# EasyEDA Pro project ProProject_无线温湿度检测系统1_2024-10-27.epro, schematic Schematic6
Create Date: 2023-12-08; Page Name: P1; Project Name: 无线温湿度检测系统1; Schematic Name: Schematic6; Update Date: 2023-12-08; Company: 嘉立创EDA; Page Size: A4; Version: V1.0
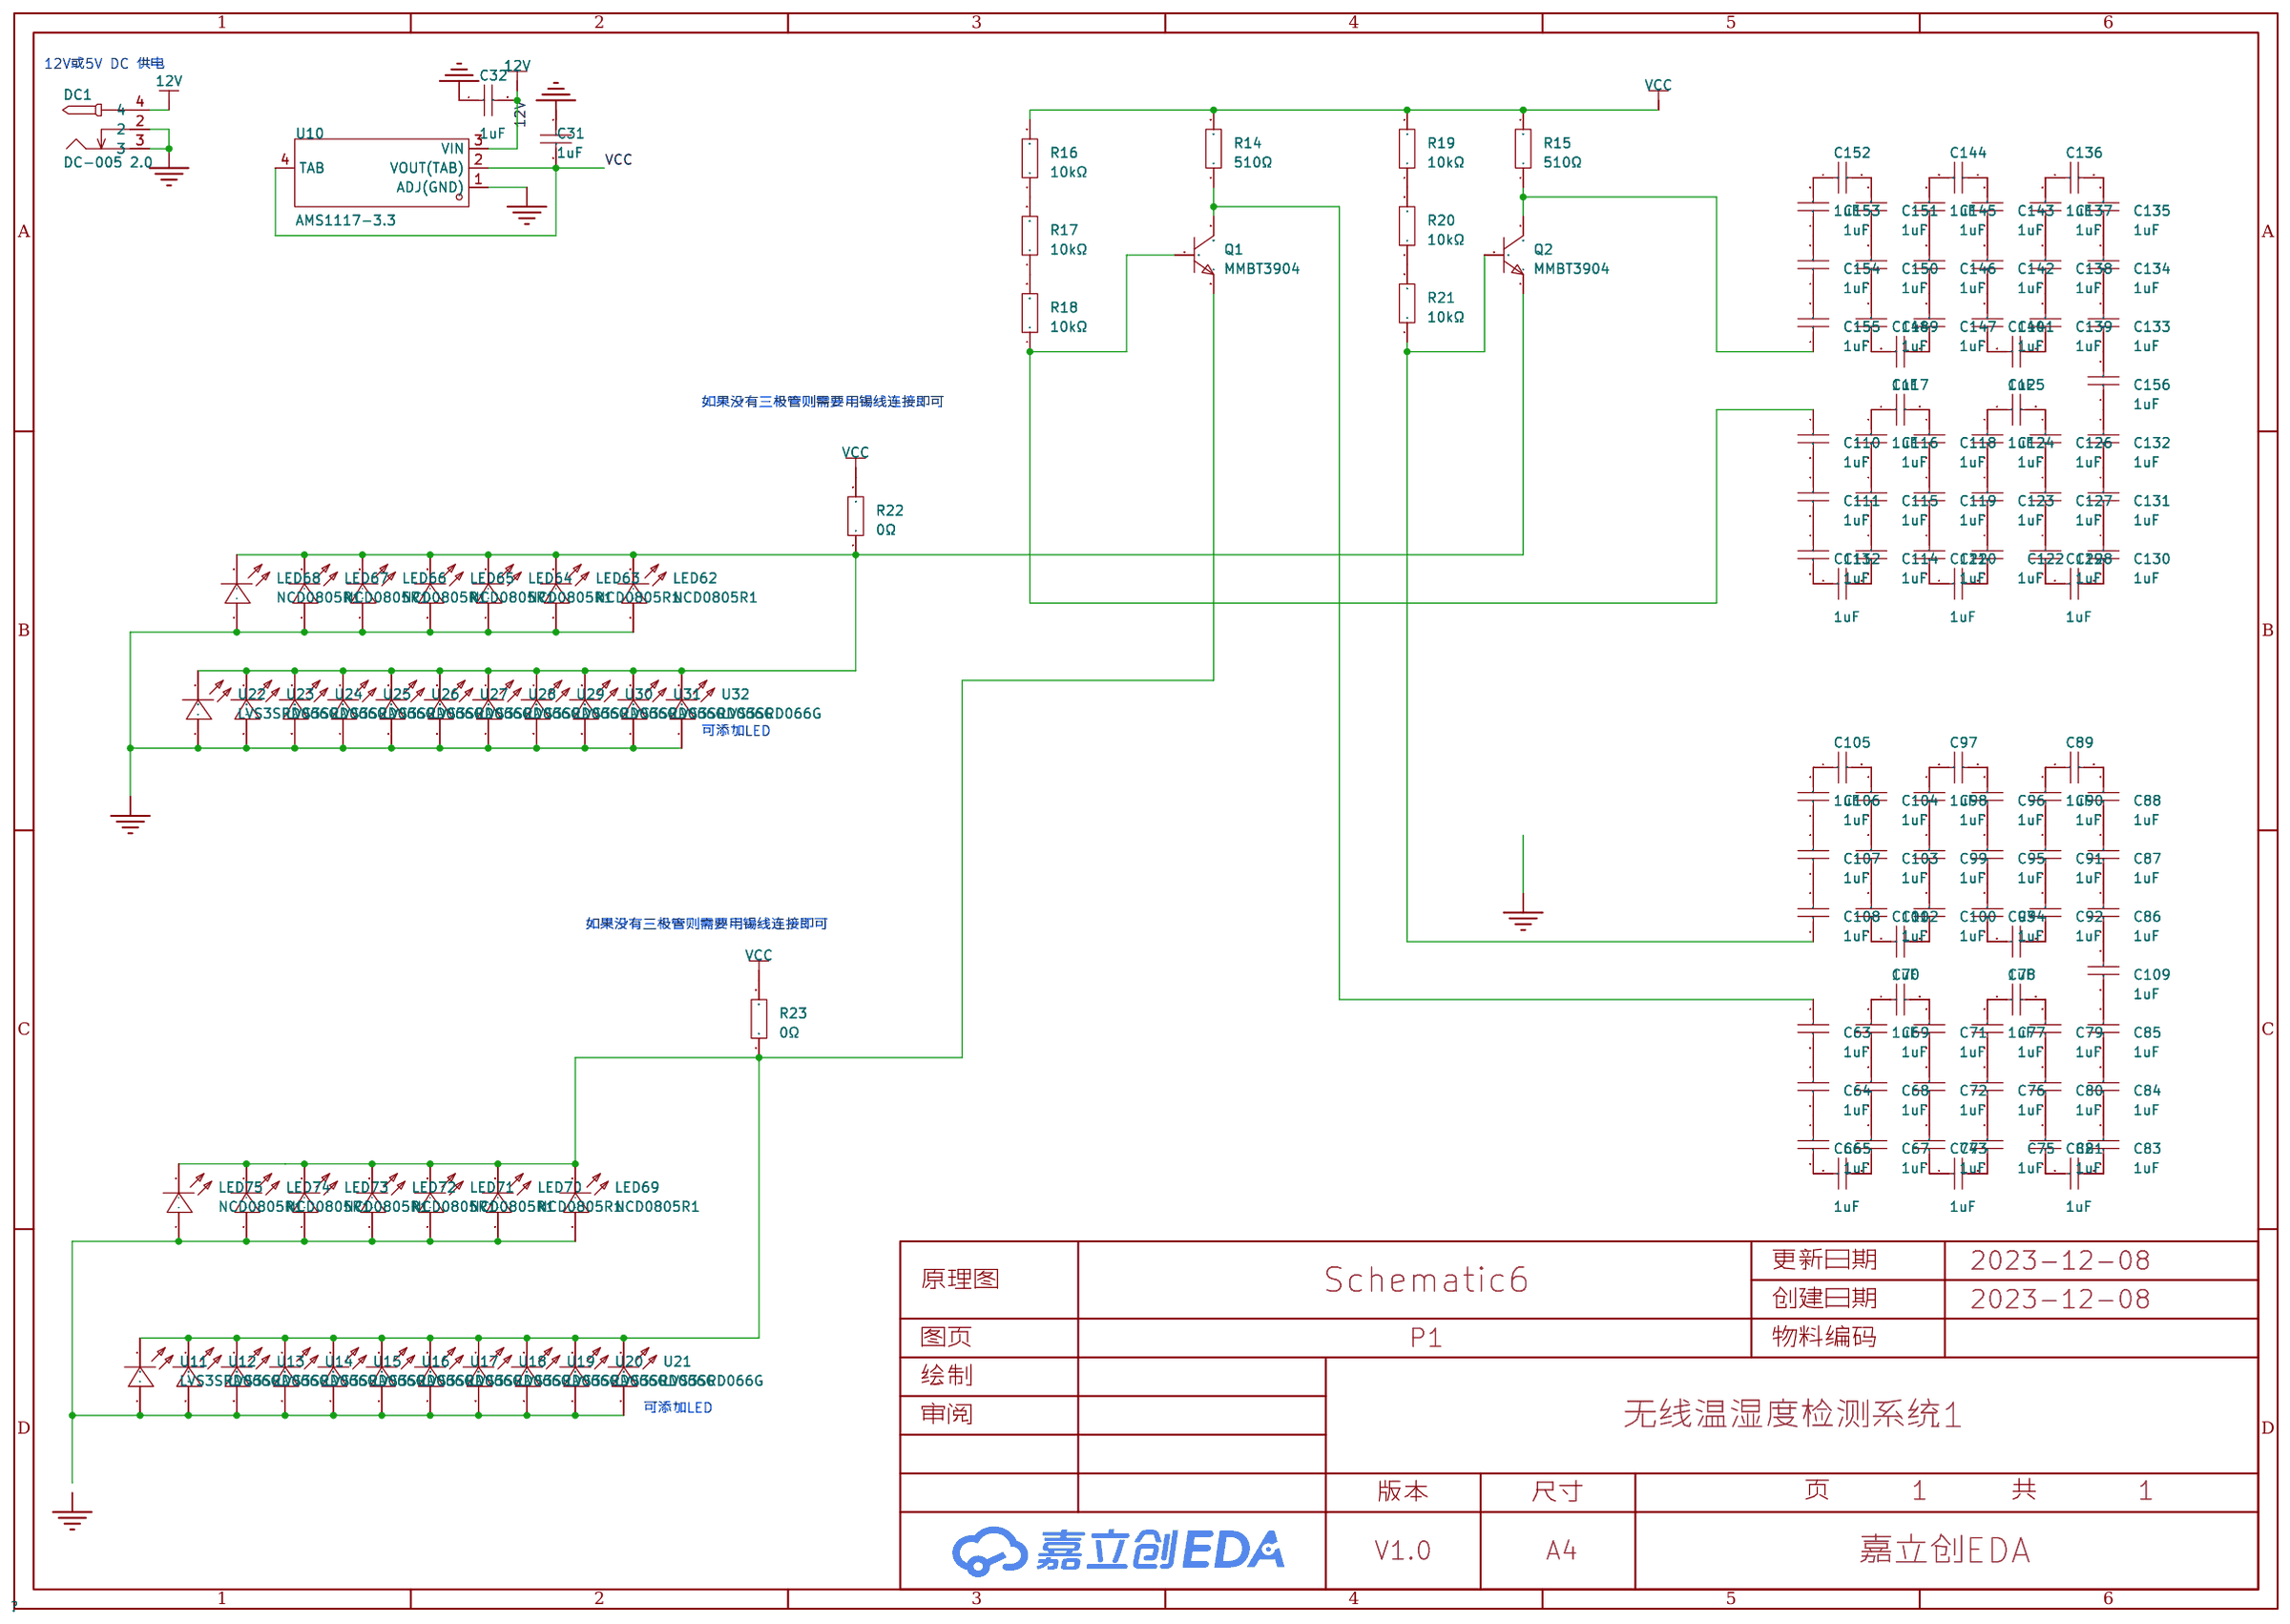
[diagram p2: schematic sheet]

## Parts
C31  1uF  [C0603]
C32  1uF  [C0603]
C63  1uF  [C0603]
C64  1uF  [C0603]
C65  1uF  [C0603]
C66  1uF  [C0603]
C67  1uF  [C0603]
C68  1uF  [C0603]
C69  1uF  [C0603]
C70  1uF  [C0603]
C71  1uF  [C0603]
C72  1uF  [C0603]
C73  1uF  [C0603]
C74  1uF  [C0603]
C75  1uF  [C0603]
C76  1uF  [C0603]
C77  1uF  [C0603]
C78  1uF  [C0603]
C79  1uF  [C0603]
C80  1uF  [C0603]
C81  1uF  [C0603]
C82  1uF  [C0603]
C83  1uF  [C0603]
C84  1uF  [C0603]
C85  1uF  [C0603]
C86  1uF  [C0603]
C87  1uF  [C0603]
C88  1uF  [C0603]
C89  1uF  [C0603]
C90  1uF  [C0603]
C91  1uF  [C0603]
C92  1uF  [C0603]
C93  1uF  [C0603]
C94  1uF  [C0603]
C95  1uF  [C0603]
C96  1uF  [C0603]
C97  1uF  [C0603]
C98  1uF  [C0603]
C99  1uF  [C0603]
C100  1uF  [C0603]
C101  1uF  [C0603]
C102  1uF  [C0603]
C103  1uF  [C0603]
C104  1uF  [C0603]
C105  1uF  [C0603]
C106  1uF  [C0603]
C107  1uF  [C0603]
C108  1uF  [C0603]
C109  1uF  [C0603]
C110  1uF  [C0603]
C111  1uF  [C0603]
C112  1uF  [C0603]
C113  1uF  [C0603]
C114  1uF  [C0603]
C115  1uF  [C0603]
C116  1uF  [C0603]
C117  1uF  [C0603]
C118  1uF  [C0603]
C119  1uF  [C0603]
C120  1uF  [C0603]
C121  1uF  [C0603]
C122  1uF  [C0603]
C123  1uF  [C0603]
C124  1uF  [C0603]
C125  1uF  [C0603]
C126  1uF  [C0603]
C127  1uF  [C0603]
C128  1uF  [C0603]
C129  1uF  [C0603]
C130  1uF  [C0603]
C131  1uF  [C0603]
C132  1uF  [C0603]
C133  1uF  [C0603]
C134  1uF  [C0603]
C135  1uF  [C0603]
C136  1uF  [C0603]
C137  1uF  [C0603]
C138  1uF  [C0603]
C139  1uF  [C0603]
C140  1uF  [C0603]
C141  1uF  [C0603]
C142  1uF  [C0603]
C143  1uF  [C0603]
C144  1uF  [C0603]
C145  1uF  [C0603]
C146  1uF  [C0603]
C147  1uF  [C0603]
C148  1uF  [C0603]
C149  1uF  [C0603]
C150  1uF  [C0603]
C151  1uF  [C0603]
C152  1uF  [C0603]
C153  1uF  [C0603]
C154  1uF  [C0603]
C155  1uF  [C0603]
C156  1uF  [C0603]
DC1  DC-005 2.0  [DC-IN-TH_DC-5520-1]
LED62  NCD0805R1  [LED0805-R-RD]
LED63  NCD0805R1  [LED0805-R-RD]
LED64  NCD0805R1  [LED0805-R-RD]
LED65  NCD0805R1  [LED0805-R-RD]
LED66  NCD0805R1  [LED0805-R-RD]
LED67  NCD0805R1  [LED0805-R-RD]
LED68  NCD0805R1  [LED0805-R-RD]
LED69  NCD0805R1  [LED0805-R-RD]
LED70  NCD0805R1  [LED0805-R-RD]
LED71  NCD0805R1  [LED0805-R-RD]
LED72  NCD0805R1  [LED0805-R-RD]
LED73  NCD0805R1  [LED0805-R-RD]
LED74  NCD0805R1  [LED0805-R-RD]
LED75  NCD0805R1  [LED0805-R-RD]
Q1  MMBT3904  [SOT-23-3_L2.9-W1.3-P1.90-LS2.4-BR]
Q2  MMBT3904  [SOT-23-3_L2.9-W1.3-P1.90-LS2.4-BR]
R14  510Ω  [R0603]
R15  510Ω  [R0603]
R16  10kΩ  [R0603]
R17  10kΩ  [R0603]
R18  10kΩ  [R0603]
R19  10kΩ  [R0603]
R20  10kΩ  [R0603]
R21  10kΩ  [R0603]
R22  0Ω  [R0402]
R23  0Ω  [R0402]
U10  AMS1117-3.3  [SOT-223-4_L6.5-W3.5-P2.30-LS7.0-BR]
U11  LVS3SRD066G  [LED-TH_L3.2-W2.0-P2.54-RD]
U12  LVS3SRD066G  [LED-TH_L3.2-W2.0-P2.54-RD]
U13  LVS3SRD066G  [LED-TH_L3.2-W2.0-P2.54-RD]
U14  LVS3SRD066G  [LED-TH_L3.2-W2.0-P2.54-RD]
U15  LVS3SRD066G  [LED-TH_L3.2-W2.0-P2.54-RD]
U16  LVS3SRD066G  [LED-TH_L3.2-W2.0-P2.54-RD]
U17  LVS3SRD066G  [LED-TH_L3.2-W2.0-P2.54-RD]
U18  LVS3SRD066G  [LED-TH_L3.2-W2.0-P2.54-RD]
U19  LVS3SRD066G  [LED-TH_L3.2-W2.0-P2.54-RD]
U20  LVS3SRD066G  [LED-TH_L3.2-W2.0-P2.54-RD]
U21  LVS3SRD066G  [LED-TH_L3.2-W2.0-P2.54-RD]
U22  LVS3SRD066G  [LED-TH_L3.2-W2.0-P2.54-RD]
U23  LVS3SRD066G  [LED-TH_L3.2-W2.0-P2.54-RD]
U24  LVS3SRD066G  [LED-TH_L3.2-W2.0-P2.54-RD]
U25  LVS3SRD066G  [LED-TH_L3.2-W2.0-P2.54-RD]
U26  LVS3SRD066G  [LED-TH_L3.2-W2.0-P2.54-RD]
U27  LVS3SRD066G  [LED-TH_L3.2-W2.0-P2.54-RD]
U28  LVS3SRD066G  [LED-TH_L3.2-W2.0-P2.54-RD]
U29  LVS3SRD066G  [LED-TH_L3.2-W2.0-P2.54-RD]
U30  LVS3SRD066G  [LED-TH_L3.2-W2.0-P2.54-RD]
U31  LVS3SRD066G  [LED-TH_L3.2-W2.0-P2.54-RD]
U32  LVS3SRD066G  [LED-TH_L3.2-W2.0-P2.54-RD]

## Library data of the parts
C31 C32 C63-C156 = CL10A105KB8NNNC: 容值:1uF;精度:±10%;额定电压:50V;材质(温度系数):X5R;; LCSC Part Name: 1uF ±10% 50V; Supplier Part: C15849; Manufacturer: SAMSUNG(三星); Supplier Footprint: 0603; JLCPCB Part Class: Basic Part; Datasheet: https://atta.szlcsc.com/upload/public/pdf/source/20160103/1457707679084.pdf; Supplier: LCSC; Tolerance: ±10%; Voltage Rated: 50V; Temperature Coefficient: X5R
DC1 = DC-005 2.0: 连接器类型:DC电源插座;安装方式:弯插;触点内径:2mm;触点外径:6.4mm;额定电流:-;额定电压:-;工作温度范围:-;; LCSC Part Name: DC电源插座 内径:2mm 外径:6.4mm 铁材质; Supplier Part: C16214; Manufacturer: BOOMELE(博穆精密); Supplier Footprint: 插件; JLCPCB Part Class: 扩展库; Datasheet: https://atta.szlcsc.com/upload/public/pdf/source/20190827/C16214_DA59F99E888FED58D9833F5341D610B0.pdf; Supplier: LCSC; Connector Type: DC电源插座; Mounting Style: 弯插; Inside Contact Diameter: 2mm; Outside Contact Diameter: 6.4mm
LED62-LED75 = NCD0805R1: 发光颜色:红灯;; LCSC Part Name: 红灯; Supplier Part: C84256; Manufacturer: 国星光电; Supplier Footprint: 0805; JLCPCB Part Class: Basic Part; Datasheet: https://atta.szlcsc.com/upload/public/pdf/source/20200820/C84256_F0A75A43B3EAD75808600A0514C76B99.pdf; Supplier: LCSC; Emitted Color: 红灯
Q1 Q2 = MMBT3904_C20526: 晶体管类型:NPN;集电极电流(Ic):200mA;集射极击穿电压(Vceo):40V;功率(Pd):200mW;直流电流增益(hFE@Ic,Vce):100@10mA,1V;; LCSC Part Name: 耐压:40V 电流:200mA NPN hfe=100~300; Supplier Part: C20526; Manufacturer: CJ(江苏长电/长晶); Supplier Footprint: SOT-23; JLCPCB Part Class: 基础库; Datasheet: https://atta.szlcsc.com/upload/public/pdf/source/20220704/70F575FB75061E03F919270A6BB8BA7F.pdf; Supplier: LCSC; Transistor Type: NPN; Collector Current (Ic): 200mA; Collector-Emitter Breakdown Voltage (Vceo): 40V; Power Dissipation (Pd): 200mW; DC Current Gain (hFE@Ic,Vce): 100@10mA,1V; Transition Frequency (fT): 300MHz; Collector Cut-Off Current (Icbo): 100nA; Collector-Emitter Saturation Voltage (VCE(sat)@Ic,Ib): 300mV@50mA,5mA; Operating Temperature: +150℃@(Tj)
R14 R15 = 0603WAF5100T5E: 电阻类型:厚膜电阻;阻值:510Ω;精度:±1%;功率:100mW;; LCSC Part Name: 510Ω ±1% 100mW; Supplier Part: C23193; Manufacturer: UNI-ROYAL(厚声); Supplier Footprint: 0603; JLCPCB Part Class: Basic Part; Datasheet: https://atta.szlcsc.com/upload/public/pdf/source/20200306/C422600_1E6D84923E4A46A82E41ADD87F860B5C.pdf; Supplier: LCSC; Type: 厚膜电阻; Tolerance: ±1%; Power(Watts): 100mW; Temperature Coefficient: ±100ppm/℃; Overload Voltage (Max): 75V; Operating Temperature Range: -55℃~+155℃
R16-R21 = 0603WAF1002T5E: 电阻类型:厚膜电阻;阻值:10kΩ;精度:±1%;功率:100mW;; LCSC Part Name: 厚膜电阻 10kΩ ±1% 100mW; Supplier Part: C25804; Manufacturer: UNI-ROYAL(厚声); Supplier Footprint: 0603; JLCPCB Part Class: 基础库; Datasheet: https://atta.szlcsc.com/upload/public/pdf/source/20200306/C422600_1E6D84923E4A46A82E41ADD87F860B5C.pdf; Supplier: LCSC; Type: 厚膜电阻; Tolerance: ±1%; Power(Watts): 100mW; Temperature Coefficient: ±100ppm/℃; Overload Voltage (Max): 75V; Operating Temperature Range: -55℃~+155℃
R22 R23 = 0402WGF0000TCE: 阻值:0Ω;精度:±1%;功率:62.5mW;温度系数:±800ppm/℃;电阻类型:厚膜电阻;; LCSC Part Name: 0Ω ±1% 62.5mW 厚膜电阻; Supplier Part: C17168; Manufacturer: UNI-ROYAL(厚声); Supplier Footprint: 0402; JLCPCB Part Class: Basic Part; Datasheet: https://atta.szlcsc.com/upload/public/pdf/source/20200306/C422600_1E6D84923E4A46A82E41ADD87F860B5C.pdf; Supplier: LCSC; Tolerance: ±1%; Power(Watts): 62.5mW; Overload Voltage (Max): 50V; Temperature Coefficient: ±800ppm/℃; Type: 厚膜电阻; Operating Temperature Range: -55℃~+155℃
U10 = AMS1117-3.3_C347222: 输出类型:固定;输出极性:正;最大输入电压:18V;输出电压:3.3V;输出电流:1A;电源纹波抑制比(PSRR):60dB@(120Hz);; LCSC Part Name: 输入18V 输出3.3V 1A; Supplier Part: C347222; Manufacturer: UMW(友台半导体); Supplier Footprint: SOT-223; JLCPCB Part Class: 扩展库; Datasheet: https://atta.szlcsc.com/upload/public/pdf/source/20211011/50CC665C22E3A66C08379A4A74BDA25C.pdf; Supplier: LCSC; Output Type: 固定; Output Polarity: 正; Number of Outputs: 1; Maximum Input Voltage: 18V; Output Voltage: 3.3V; Dropout Voltage: 1.3V@(1A); Output Current: 1A; Power Supply Rejection Ratio (PSRR): 60dB@(120Hz)
U11-U32 = LVS3SRD066G: 发光颜色:红灯;二极管配置:-;主波长:642nm;色温:-;功率:48mW;安装方式:-;; LCSC Part Name: 红灯; Supplier Part: C2929603; Manufacturer: PARALIGHT(光鼎); Supplier Footprint: 插件,D=3.1mm; JLCPCB Part Class: 扩展库; Datasheet: https://atta.szlcsc.com/upload/public/pdf/source/20211209/FB4184BF6335E1AFE96C5CC31CD761FB.pdf; Supplier: LCSC; Emitted Color: 红灯; Lens Color: 雾状红; Dominant Wavelength: 642nm; Forward Current: 20mA; Power Dissipation: 48mW; Viewing Angle: 120°; Operating Temperature: -40℃~+85℃; Lamp Holder Type: 3.1mm方形灯头

## Nets
12V: C32.2 DC1.4 U10.3(VIN)
GND: C31.1 C32.1 DC1.2 DC1.3 LED62.1(+) LED63.1(+) LED64.1(+) LED65.1(+) LED66.1(+) LED67.1(+) LED68.1(+) U10.1(ADJ(GND)) U22.2(A) U23.2(A) U24.2(A) U25.2(A) U26.2(A) U27.2(A) U28.2(A) U29.2(A) U30.2(A) U31.2(A) U32.2(A)
VCC: C31.2 R14.2 R15.2 R16.2 R19.2 R22.2 R23.2 U10.2(VOUT(TAB)) U10.4(TAB)
$1N3222: LED62.2(-) LED63.2(-) LED64.2(-) LED65.2(-) LED66.2(-) LED67.2(-) LED68.2(-) Q2.2(E) R22.1 U22.1(C) U23.1(C) U24.1(C) U25.1(C) U26.1(C) U27.1(C) U28.1(C) U29.1(C) U30.1(C) U31.1(C) U32.1(C)
$1N3322: R16.1 R17.2
$1N3361: R17.1 R18.2
$1N3455: C63.1 Q1.3(C) R14.1
$1N3577: R19.1 R20.2
$1N3579: R20.1 R21.2
$1N4260: C66.1 C67.2
$1N4262: C67.1 C68.2
$1N4264: C68.1 C69.2
$1N4266: C71.2 C72.1
$1N4268: C72.2 C73.1
$1N4270: C73.2 C74.1
$1N4272: C74.2 C75.2
$1N4274: C75.1 C76.2
$1N4276: C76.1 C77.2
$1N4278: C63.2 C64.1
$1N4280: C64.2 C65.1
$1N4282: C65.2 C66.2
$1N4284: C69.1 C70.1
$1N4286: C70.2 C71.1
$1N4322: C77.1 C78.1
$1N4868: C82.1 C83.2
$1N4870: C83.1 C84.2
$1N4872: C84.1 C85.2
$1N4886: C79.2 C80.1
$1N4888: C80.2 C81.1
$1N4890: C81.2 C82.2
$1N4898: C78.2 C79.1
$1N5934: C89.1 C90.2
$1N5936: C90.1 C91.2
$1N5938: C91.1 C92.2
$1N5940: C94.2 C95.1
$1N5942: C95.2 C96.1
$1N5944: C96.2 C97.1
$1N5946: C97.2 C98.2
$1N5948: C98.1 C99.2
$1N5950: C99.1 C100.2
$1N5952: C86.2 C87.1
$1N5954: C87.2 C88.1
$1N5956: C88.2 C89.2
$1N5958: C92.1 C93.1
$1N5960: C93.2 C94.1
$1N5962: C100.1 C101.1
$1N5964: C105.1 C106.2
$1N5966: C106.1 C107.2
$1N5968: C107.1 C108.2
$1N5970: C102.2 C103.1
$1N5972: C103.2 C104.1
$1N5974: C104.2 C105.2
$1N5976: C101.2 C102.1
$1N6012: C85.1 C109.1
$1N6014: C86.1 C109.2
$1N6018: C108.1 Q2.1(B) R21.1
$1N6022: C155.1 Q2.3(C) R15.1
$1N7649: C113.1 C114.2
$1N7651: C114.1 C115.2
$1N7653: C115.1 C116.2
$1N7655: C118.2 C119.1
$1N7657: C119.2 C120.1
$1N7659: C120.2 C121.1
$1N7661: C121.2 C122.2
$1N7663: C122.1 C123.2
$1N7665: C123.1 C124.2
$1N7667: C110.2 C111.1
$1N7669: C111.2 C112.1
$1N7671: C112.2 C113.2
$1N7673: C116.1 C117.1
$1N7675: C117.2 C118.1
$1N7677: C124.1 C125.1
$1N7679: C129.1 C130.2
$1N7681: C130.1 C131.2
$1N7683: C131.1 C132.2
$1N7685: C126.2 C127.1
$1N7687: C127.2 C128.1
$1N7689: C128.2 C129.2
$1N7691: C125.2 C126.1
$1N7693: C136.1 C137.2
$1N7695: C137.1 C138.2
$1N7697: C138.1 C139.2
$1N7699: C141.2 C142.1
$1N7701: C142.2 C143.1
$1N7703: C143.2 C144.1
$1N7705: C144.2 C145.2
$1N7707: C145.1 C146.2
$1N7709: C146.1 C147.2
$1N7711: C133.2 C134.1
$1N7713: C134.2 C135.1
$1N7715: C135.2 C136.2
$1N7717: C139.1 C140.1
$1N7719: C140.2 C141.1
$1N7721: C147.1 C148.1
$1N7723: C152.1 C153.2
$1N7725: C153.1 C154.2
$1N7727: C154.1 C155.2
$1N7729: C149.2 C150.1
$1N7731: C150.2 C151.1
$1N7733: C151.2 C152.2
$1N7735: C148.2 C149.1
$1N7737: C132.1 C156.1
$1N7739: C133.1 C156.2
$1N7747: C110.1 Q1.1(B) R18.1
$1N9331: LED69.2(-) LED70.2(-) LED71.2(-) LED72.2(-) LED73.2(-) LED74.2(-) LED75.2(-) Q1.2(E) R23.1 U11.1(C) U12.1(C) U13.1(C) U14.1(C) U15.1(C) U16.1(C) U17.1(C) U18.1(C) U19.1(C) U20.1(C) U21.1(C)
$1N9384: LED69.1(+) LED70.1(+) LED71.1(+) LED72.1(+) LED73.1(+) LED74.1(+) LED75.1(+) U11.2(A) U12.2(A) U13.2(A) U14.2(A) U15.2(A) U16.2(A) U17.2(A) U18.2(A) U19.2(A) U20.2(A) U21.2(A)

## Notes on the sheet
- 12V或5V DC 供电
- 如果没有三极管则需要用锡线连接即可
- 可添加LED
- 如果没有三极管则需要用锡线连接即可
- 可添加LED
